# Altium schematic sheet LPS22HBTR.SchDoc
size A4; SheetNumber: 4; SheetTotal: 11
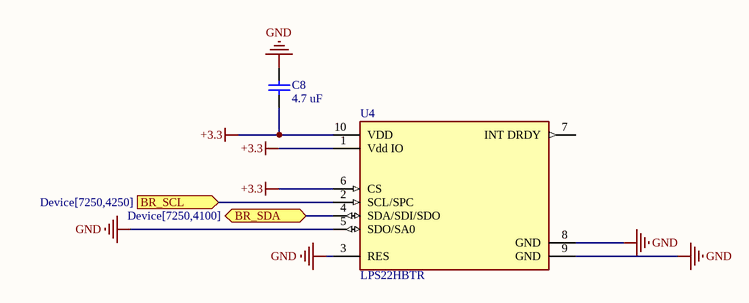
[diagram p0: LPS22HBTR.SchDoc]

## Parts
C8  4.7 uF  [CAPC1005X55X25NL05T10]
U4  LPS22HBTR  [FP-HLGA-10L-8479831-0]

## Ports
BR_SCL (in, see Device[7250,4250]), BR_SDA (bidir, see Device[7250,4100])

## Nets
+3.3: C8.2 U4.1(Vdd_IO) U4.6(CS) U4.10(VDD)
GND: C8.1 U4.3(RES) U4.5(SDO/SA0) U4.8(GND) U4.9(GND)
BR_SCL: U4.2(SCL/SPC) ; port BR_SCL
BR_SDA: U4.4(SDA/SDI/SDO) ; port BR_SDA

Not connected (* = marked no-connect by the designer): U4 7(INT_DRDY)

## Library data of the parts
C8 = CMP-2008-04515-1: Manufacturer: Murata; Part Number: GRM155F50J684ZE01D
U4 = CMP-12182-000004-1: MEMS NANO PRESSURE SENSOR: 260-1; Manufacturer: STMicroelectronics; Sensor Output: I2C,SPI; Port Style: No Port; Max Supply Voltage: 3.6V; Operating Supply Current: 3-12uA; Min Supply Voltage: 1.7V; Device Class L3: unset; Device Class L1: Sensors; Manufacturer Part Number: LPS22HBTR; Temperature Range High: +85°C; Digikey Description: MEMS NANO PRESSURE SENSOR: 260-1; Device Class L2: Pressure Sensors; RoHS: TRUE; Lead Free: Yes; Height: 0.8mm; Automotive: No; Octopart: https://octopart.com/lps22hbtr-stmicroelectronics-51851131; Package: HLGA-10L-8479831; Temperature Range Low: -40°C; Category: IC; Temperature: -40°C to +85°C; ComponentLink2Description: Datasheet; ComponentLink2URL: https://www.st.com/resource/en/datasheet/lps22hb.pdf; Footprint Url: https://www.st.com/content/ccc/resource/technical/document/technical_note/73/17/9c/16/dd/96/4a/01/CD00134799.pdf/files/CD00134799.pdf/jcr:content/translations/en.CD00134799.pdf